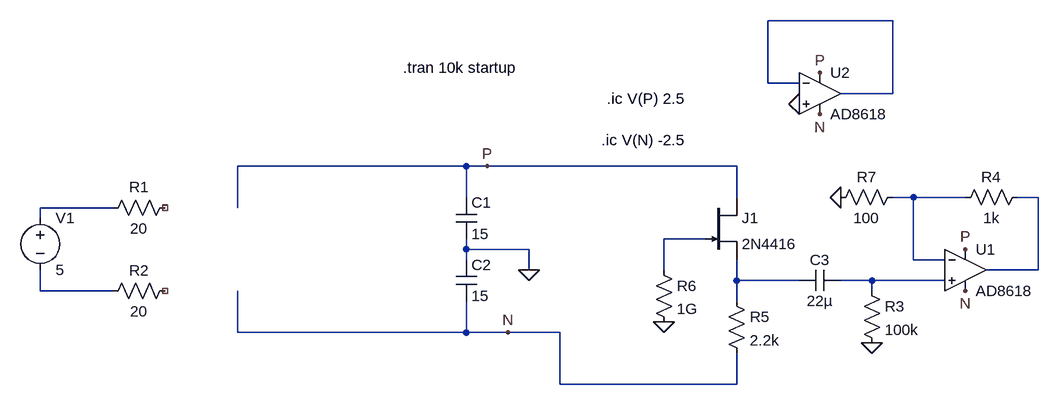
[diagram p0: schematic Microphone_Amp_Supercap_Sims.asc]
Microphone_Amp_Supercap_Sims.asc, the LTspice schematic file:
Version 4
SHEET 1 880 680
WIRE 496 -96 304 -96
WIRE 304 0 304 -96
WIRE 352 0 304 0
WIRE 496 16 496 -96
WIRE 496 16 416 16
WIRE -160 128 -512 128
WIRE -128 128 -160 128
WIRE 256 128 -128 128
WIRE -160 176 -160 128
WIRE 256 176 256 128
WIRE 528 176 496 176
WIRE 608 176 528 176
WIRE 720 176 688 176
WIRE -704 192 -816 192
WIRE -512 192 -512 128
WIRE -816 208 -816 192
WIRE 208 240 144 240
WIRE -160 256 -160 240
WIRE -64 256 -160 256
WIRE -160 272 -160 256
WIRE 528 272 528 176
WIRE 576 272 528 272
WIRE -64 288 -64 256
WIRE 144 288 144 240
WIRE 720 288 720 176
WIRE 720 288 640 288
WIRE 256 304 256 272
WIRE 352 304 256 304
WIRE 464 304 416 304
WIRE 576 304 464 304
WIRE -816 320 -816 288
WIRE -704 320 -816 320
WIRE 464 320 464 304
WIRE 256 336 256 304
WIRE -512 384 -512 320
WIRE -160 384 -160 336
WIRE -160 384 -512 384
WIRE -96 384 -160 384
WIRE -16 384 -96 384
WIRE -16 464 -16 384
WIRE 256 464 256 416
WIRE 256 464 -16 464
FLAG -128 128 P
FLAG -64 288 0
FLAG -96 384 N
FLAG 144 368 0
FLAG 352 32 0
FLAG 384 -16 P
FLAG 384 48 N
FLAG 608 256 P
FLAG 608 320 N
FLAG 464 400 0
FLAG 416 176 0
SYMBOL cap -176 176 R0
SYMATTR InstName C1
SYMATTR Value 15
SYMBOL voltage -816 192 R0
SYMATTR InstName V1
SYMATTR Value 5
SYMBOL res -608 176 R90
WINDOW 0 0 56 VBottom 2
WINDOW 3 32 56 VTop 2
SYMATTR InstName R1
SYMATTR Value 20
SYMBOL res -608 304 R90
WINDOW 0 0 56 VBottom 2
WINDOW 3 32 56 VTop 2
SYMATTR InstName R2
SYMATTR Value 20
SYMBOL cap -176 272 R0
SYMATTR InstName C2
SYMATTR Value 15
SYMBOL njf 208 176 R0
SYMATTR InstName J1
SYMATTR Value 2N4416
SYMBOL res 240 320 R0
SYMATTR InstName R5
SYMATTR Value 2.2k
SYMBOL res 128 272 R0
SYMATTR InstName R6
SYMATTR Value 1G
SYMBOL Opamps\\AD8618 384 -48 R0
SYMATTR InstName U2
SYMBOL Opamps\\AD8618 608 224 R0
SYMATTR InstName U1
SYMBOL cap 416 288 R90
WINDOW 0 0 32 VBottom 2
WINDOW 3 32 32 VTop 2
SYMATTR InstName C3
SYMATTR Value 22µ
SYMBOL res 448 304 R0
SYMATTR InstName R3
SYMATTR Value 100k
SYMBOL res 704 160 R90
WINDOW 0 0 56 VBottom 2
WINDOW 3 32 56 VTop 2
SYMATTR InstName R4
SYMATTR Value 1k
SYMBOL res 512 160 R90
WINDOW 0 0 56 VBottom 2
WINDOW 3 32 56 VTop 2
SYMATTR InstName R7
SYMATTR Value 100
TEXT -258 -24 Left 2 !.tran 10k startup
TEXT 56 24 Left 2 !.ic V(P) 2.5
TEXT 48 88 Left 2 !.ic V(N) -2.5

The netlist it stands for:
* Microphone_Amp_Supercap_Sims.asc
C1 P 0 15
V1 N004 N008 5
R1 NC_01 N004 20
R2 NC_02 N008 20
C2 0 N 15
J1 P N005 N006 2N4416
R5 N006 N 2.2k
R6 N005 0 1G
XU2 0 N001 P N N001 AD8618  ; pins In+ In- V+ V- OUT
XU1 N007 N002 P N N003 AD8618  ; pins In+ In- V+ V- OUT
C3 N007 N006 22µ
R3 N007 0 100k
R4 N003 N002 1k
R7 N002 0 100
.model NJF NJF
.model PJF PJF
.lib standard.jft
.tran 10k startup
.ic V(P) 2.5
.ic V(N) -2.5
.backanno
.end